# EAGLE design flasher (EAGLE 7.7.0)
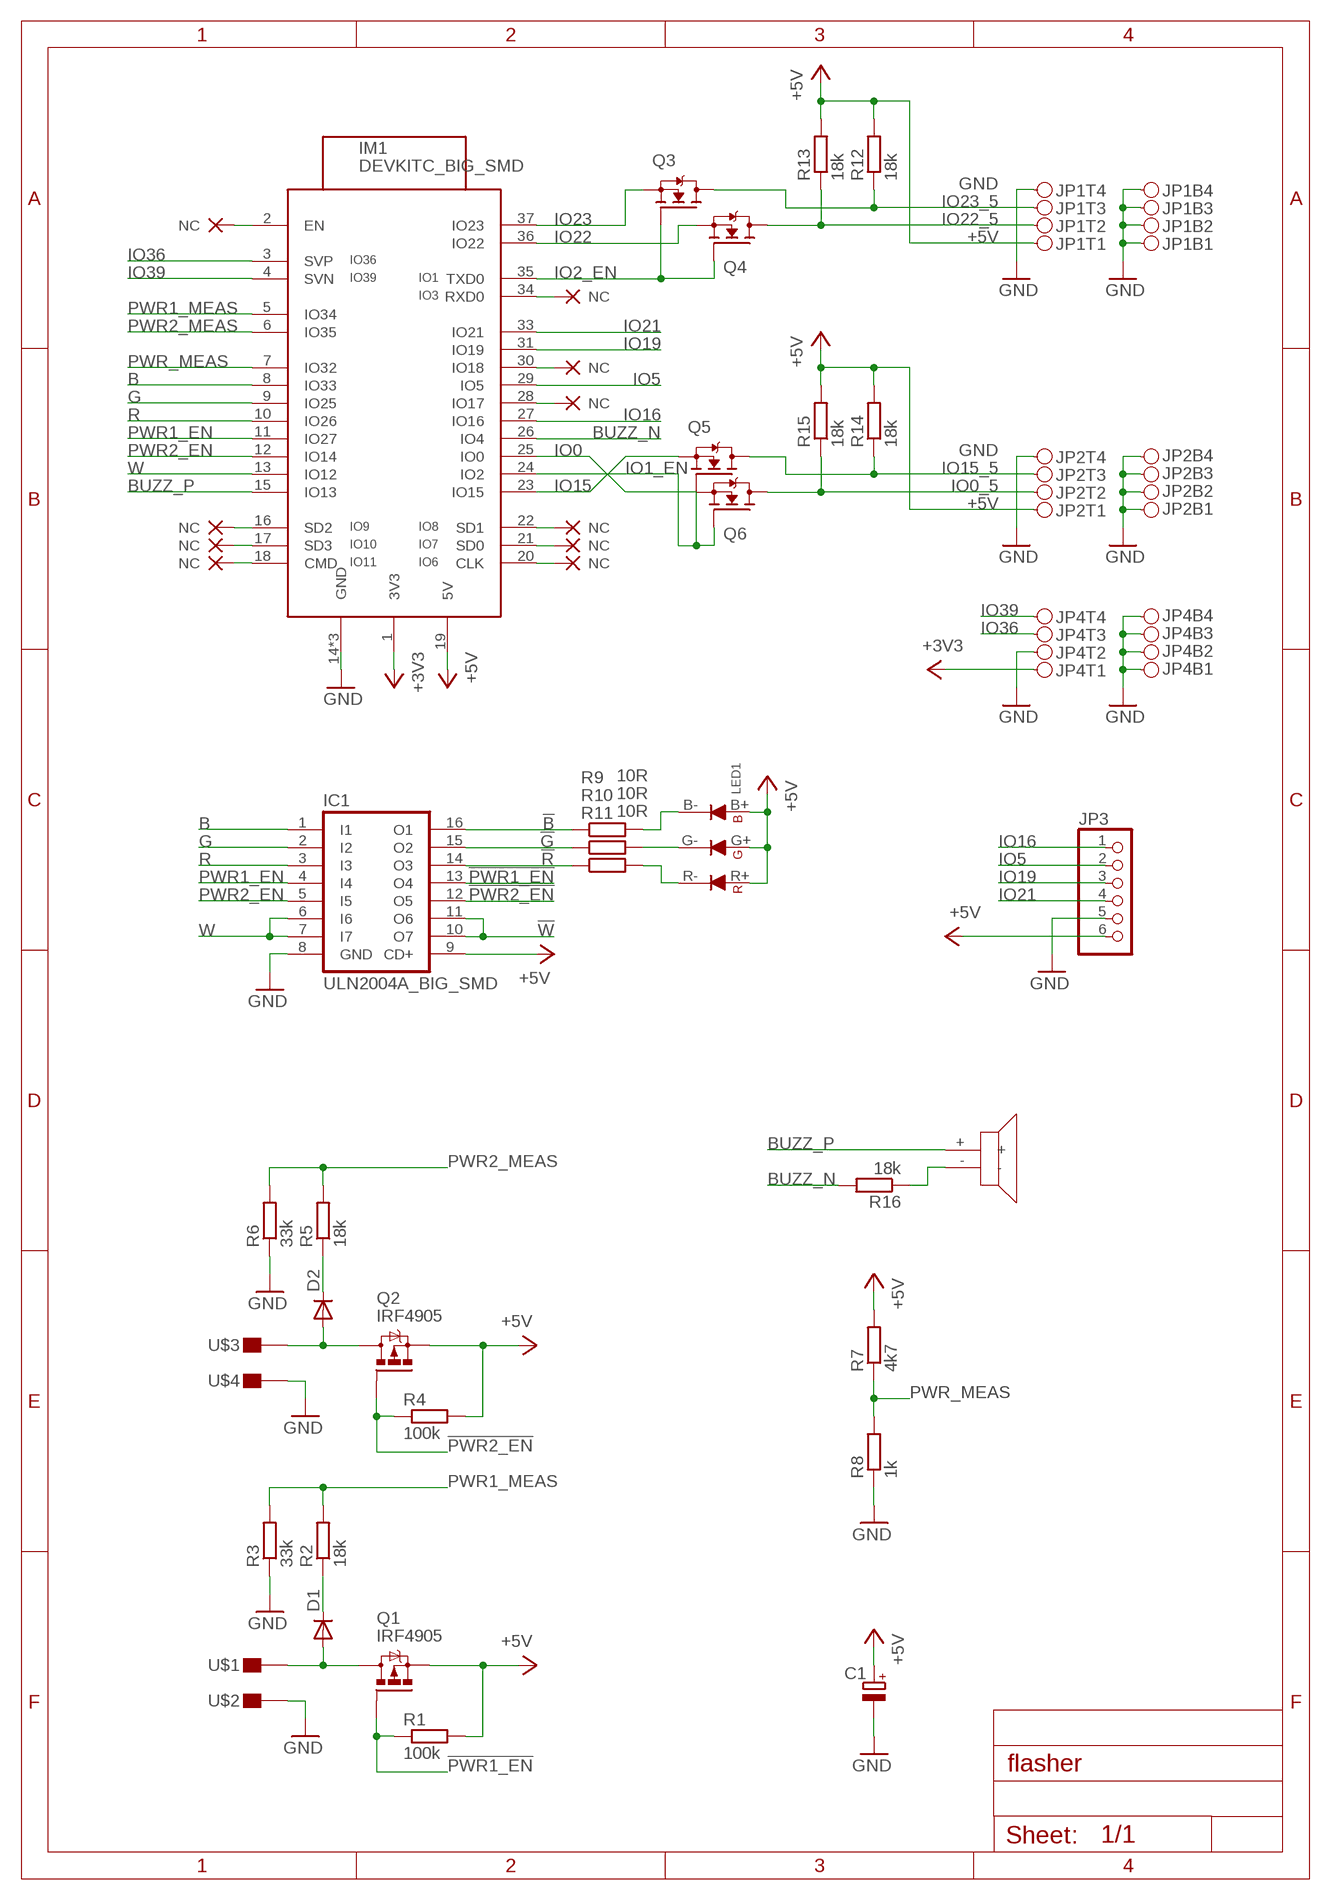
[diagram p0: schematic, sheet 1]

## Parts
C1  CPOL-EUE5-10.5  [E5-10,5]
D1  DIODE-SOD123  [SOD123]
D2  DIODE-SOD123  [SOD123]
IC1  ULN2004A_BIG_SMD  [DIL16_BIG_SMD]
IM1  DEVKITC_BIG_SMD  [DEVKITC_BIG_SMD]
JP1  PINH2X04  [PINH2X04SMD]
JP2  PINH2X04  [PINH2X04SMD]
JP3  PINHD-1X6  [1X06]
JP4  PINH2X04  [PINH2X04SMD]
LED1  RGB_LED  [HEX_HEATSINK]
NC1  NC  (no package)
NC2  NC  (no package)
NC3  NC  (no package)
NC4  NC  (no package)
NC5  NC  (no package)
NC6  NC  (no package)
NC7  NC  (no package)
NC8  NC  (no package)
NC9  NC  (no package)
NC10  NC  (no package)
Q1  IRF4905  IRF9530  [TO220BV]
Q2  IRF4905  IRF9530  [TO220BV]
Q3  N-MOSFET-SOT23-DIST  [SOT23_DIST]
Q4  N-MOSFET-SOT23-DIST  [SOT23_DIST]
Q5  N-MOSFET-SOT23-DIST  [SOT23_DIST]
Q6  N-MOSFET-SOT23-DIST  [SOT23_DIST]
R1  100k  R-EU_R0805S  [R0805S]
R2  18k  R-EU_R0805S  [R0805S]
R3  33k  R-EU_R0805S  [R0805S]
R4  100k  R-EU_R0805S  [R0805S]
R5  18k  R-EU_R0805S  [R0805S]
R6  33k  R-EU_R0805S  [R0805S]
R7  4k7  R-EU_R0805S  [R0805S]
R8  1k  R-EU_R0805S  [R0805S]
R9  10R  R-EU_R2512  [R2512]
R10  10R  R-EU_R2512  [R2512]
R11  10R  R-EU_R2512  [R2512]
R12  18k  R-EU_R0805S  [R0805S]
R13  18k  R-EU_R0805S  [R0805S]
R14  18k  R-EU_R0805S  [R0805S]
R15  18k  R-EU_R0805S  [R0805S]
R16  18k  R-EU_R0805S  [R0805S]
U$1  PAD_1SIDE_SMALL  [2X3MM]
U$2  PAD_1SIDE_SMALL  [2X3MM]
U$3  PAD_1SIDE_SMALL  [2X3MM]
U$4  PAD_1SIDE_SMALL  [2X3MM]
U$5  PIEZO  [PIEZO]

## Nets
!B: IC1.16(O1) R9.1
!G: IC1.15(O2) R10.1
!PWR1_EN: IC1.13(O4) Q1.G R1.1
!PWR2_EN: IC1.12(O5) Q2.G R4.1
!R: IC1.14(O3) R11.1
!W: IC1.10(O7) IC1.11(O6)
+3V3: IM1.1(3V3) JP4.T1
+5V: C1.+ IC1.9(CD+) IM1.19(5V) JP1.T1 JP2.T1 JP3.6 LED1.B+(BA) LED1.G+(GA) LED1.R+(RA) Q1.S Q2.S R1.2 R4.2 R7.2 R12.2 R13.2 R14.2 R15.2
B: IC1.1(I1) IM1.8(IO33)
BA: LED1.B-(BC) R9.2
BUZZ-N: R16.1 U$5.-
BUZZ_N: IM1.26(IO4) R16.2
BUZZ_P: IM1.15(IO13) U$5.+
EN: IM1.2(EN) NC7.NC
G: IC1.2(I2) IM1.9(IO25)
GA: LED1.G-(GC) R10.2
GND: C1.- IC1.8(GND) IM1.14(GND) IM1.32(GND) IM1.38(GND) JP1.B1 JP1.B2 JP1.B3 JP1.B4 JP1.T4 JP2.B1 JP2.B2 JP2.B3 JP2.B4 JP2.T4 JP3.5 JP4.B1 JP4.B2 JP4.B3 JP4.B4 JP4.T2 R3.1 R6.1 R8.1 U$2.1 U$4.1
IO0: IM1.25(IO0) Q6.2(S)
IO0_5: JP2.T2 Q6.3(D) R15.1
IO1_EN: IM1.24(IO2) Q5.1(G) Q6.1(G)
IO2_EN: IM1.35(TXD0) Q3.1(G) Q4.1(G)
IO3: IM1.34(RXD0) NC10.NC
IO5: IM1.29(IO5) JP3.2
IO6: IM1.20(CLK) NC4.NC
IO7: IM1.21(SD0) NC5.NC
IO8: IM1.22(SD1) NC6.NC
IO9: IM1.16(SD2) NC1.NC
IO10: IM1.17(SD3) NC2.NC
IO11: IM1.18(CMD) NC3.NC
IO15: IM1.23(IO15) Q5.2(S)
IO15_5: JP2.T3 Q5.3(D) R14.1
IO16: IM1.27(IO16) JP3.1
IO17: IM1.28(IO17) NC9.NC
IO18: IM1.30(IO18) NC8.NC
IO19: IM1.31(IO19) JP3.3
IO21: IM1.33(IO21) JP3.4
IO22: IM1.36(IO22) Q4.2(S)
IO22_5: JP1.T2 Q4.3(D) R13.1
IO23: IM1.37(IO23) Q3.2(S)
IO23_5: JP1.T3 Q3.3(D) R12.1
IO36: IM1.3(SVP) JP4.T3
IO39: IM1.4(SVN) JP4.T4
PWR1: D1.A Q1.D U$1.1
PWR1+: D1.C R2.1
PWR1_EN: IC1.4(I4) IM1.11(IO27)
PWR1_MEAS: IM1.5(IO34) R2.2 R3.2
PWR2: D2.A Q2.D U$3.1
PWR2+: D2.C R5.1
PWR2_EN: IC1.5(I5) IM1.12(IO14)
PWR2_MEAS: IM1.6(IO35) R5.2 R6.2
PWR_MEAS: IM1.7(IO32) R7.1 R8.2
R: IC1.3(I3) IM1.10(IO26)
RA: LED1.R-(RC) R11.2
W: IC1.6(I6) IC1.7(I7) IM1.13(IO12)

## Library data of the parts
C1 = rcl_upravena:CPOL-EU: POLARIZED CAPACITOR, European symbol
D1 D2 = diode:DIODE: DIODE ultra fast-recovery rectifier
IC1 = uln-udn_upravena:ULN2004A: DRIVER ARRAY
IM1 = esp32:DEVKITC
JP1 JP2 JP4 = pinhead_smd:PINH2X04
JP3 = pinhead:PINHD-1X6: PIN HEADER
LED1 = RGB_LED:RGB_LED
NC1-NC10 = NC:NC: _EXTERNAL_
Q1 Q2 = transistor-power:IRF9530: P-CHANNEL HEXFET POWER-MOS-FET Source: http://www.irf.com/product-info/datasheets/data/irf9530.pdf
Q3-Q6 = transistors:N-MOSFET
R1-R16 = rcl_upravena:R-EU_: RESISTOR, European symbol
U$1-U$4 = wirepad_smd:PAD
U$5 = piezo:PIEZO

## Board
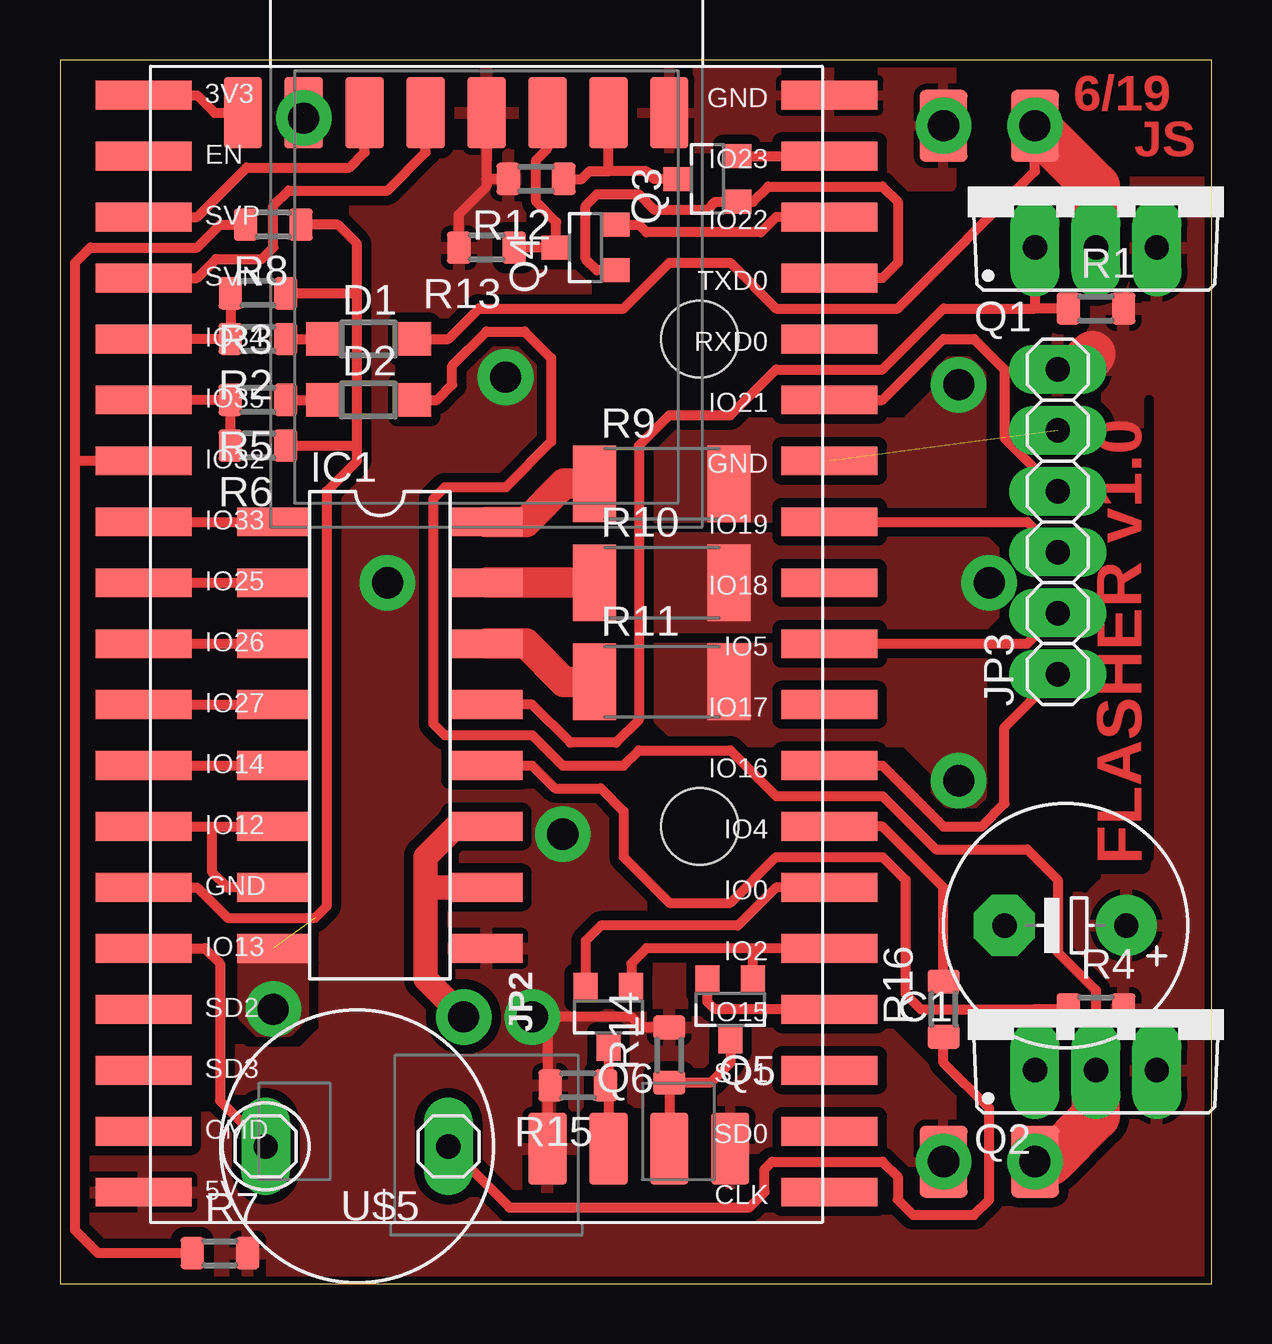
[diagram p1: board, top side]
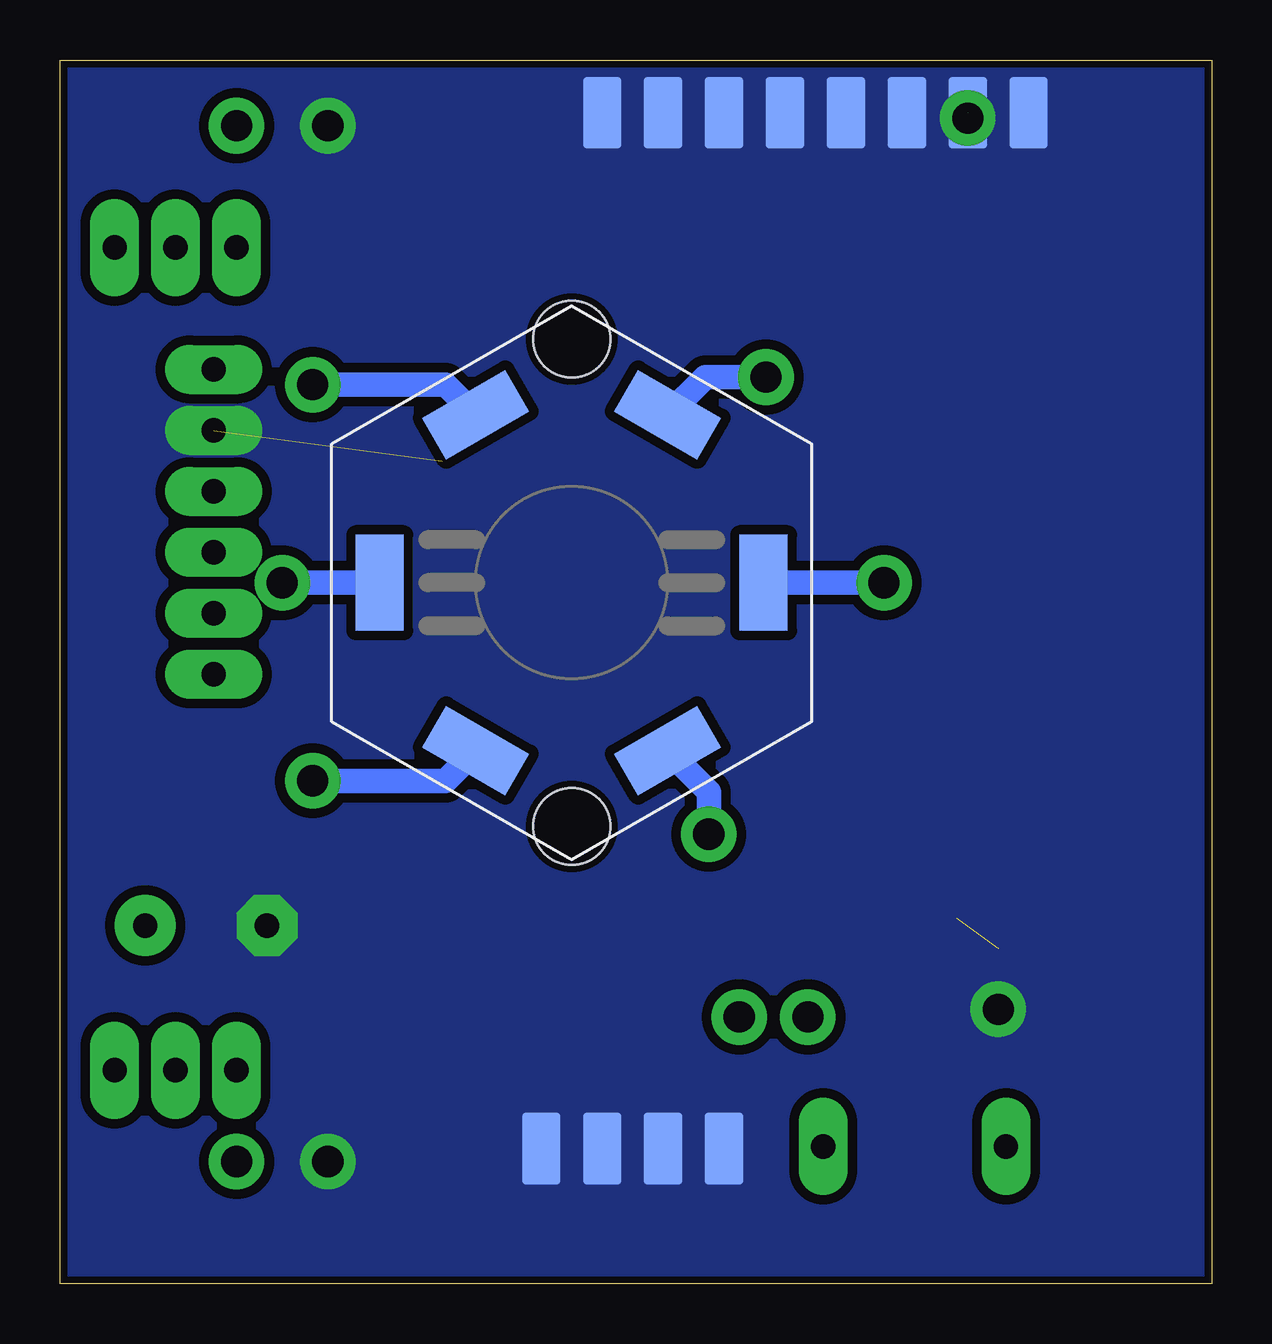
[diagram p2: board, bottom side, seen from below]

Size 48 x 51 mm. Coordinates in mm from the lower left corner, seen from the top.
Outline: 0,0 48,0 48,51 0,51 0,0
Copper layers (1*16): Top 0.035mm / dielectric 1.5mm / Bottom 0.035mm
Design rules "default *": minimum track width 0.4mm, minimum drill 0.8mm, track to track 0.4mm, track to pad 0.4mm, pad to pad 0.4mm, via to via 0.4mm, smd to smd 0mil, copper to edge 0.3mm, drill to drill 8mil, minimum pad ring 0.4mm, minimum via ring 0.3mm, stop-mask expansion 4mil, vias tented up to drill 0mil, thermal gap 10mil
Holes 3.2 mm at 26.67,39.37 26.67,19.05
tRestrict: area 23.8,16.2 to 29.6,21.9; area 23.8,36.5 to 29.6,42.3; 3 lines

### Footprints (pad centres in the part's own frame; a part is rotated, then mirrored left to right if it is on the bottom)
E5-10,5 = drill 1.016 pad 2.54: + -2.54,0 | drill 1.016 pad 2.54 octagon: - 2.54,0
SOD123 = smd 1.4 x 1.4: A 1.9,0; C -1.9,0
DIL16_BIG_SMD = smd 1.2 x 3: 1 -8.89,-4.445; 2 -6.35,-4.445; 3 -3.81,-4.445; 4 -1.27,-4.445; 5 1.27,-4.445; 6 3.81,-4.445; 7 6.35,-4.445; 8 8.89,-4.445; 9 8.89,4.445; 10 6.35,4.445; 11 3.81,4.445; 12 1.27,4.445; 13 -1.27,4.445; 14 -3.81,4.445; 15 -6.35,4.445; 16 -8.89,4.445
DEVKITC_BIG_SMD = smd 4 x 1.2: 1 -14.3,46.99; 2 -14.3,44.45; 3 -14.3,41.91; 4 -14.3,39.37; 5 -14.3,36.83; 6 -14.3,34.29; 7 -14.3,31.75; 8 -14.3,29.21; 9 -14.3,26.67; 10 -14.3,24.13; 11 -14.3,21.59; 12 -14.3,19.05; 13 -14.3,16.51; 14 -14.3,13.97; 15 -14.3,11.43; 16 -14.3,8.89; 17 -14.3,6.35; 18 -14.3,3.81; 19 -14.3,1.27; 20 14.3,1.27; 21 14.3,3.81; 22 14.3,6.35; 23 14.3,8.89; 24 14.3,11.43; 25 14.3,13.97; 26 14.3,16.51; 27 14.3,19.05; 28 14.3,21.59; 29 14.3,24.13; 30 14.3,26.67; 31 14.3,29.21; 32 14.3,31.75; 33 14.3,34.29; 34 14.3,36.83; 35 14.3,39.37; 36 14.3,41.91; 37 14.3,44.45; 38 14.3,46.99
PINH2X04SMD = smd 1.6 x 3 bottom: B1 -3.81,-2; B2 -1.27,-2; B3 1.27,-2; B4 3.81,-2 | smd 1.6 x 3: T1 -3.81,-2; T2 -1.27,-2; T3 1.27,-2; T4 3.81,-2
1X06 = drill 1.016 long: 1 -6.35,0; 2 -3.81,0; 3 -1.27,0; 4 1.27,0; 5 3.81,0; 6 6.35,0
HEX_HEATSINK = smd 4 x 2 rotated 330: B+ 4,7; R- -4,-7 | smd 4 x 2 rotated 210: B- -4,7; R+ 4,-7 | smd 2 x 4: G+ 8,0; G- -8,0
TO220BV = drill 1.016 long: D 0,-2.54; G -2.54,-2.54; S 2.54,-2.54
SOT23_DIST = smd 1 x 1.2: 1 -0.95,-1.227; 2 0.95,-1.227; 3 0,1.227
R0805S = smd 1 x 1.35: 1 -1.15,0; 2 1.15,0
R2512 = smd 1.8 x 3.2: 1 -2.8,0; 2 2.8,0
2X3MM = smd 2 x 3: 1 0,0
PIEZO = drill 1.016 long: + 1.27,8.89; - 1.27,1.27

### Placement (x,y rotation side)
C1  41.91,14.92 180 top
D1  12.86,39.37 0 top
D2  12.86,36.83 0 top
IC1  13.33,22.86 270 top
IM1  17.78,2.54 0 top
JP1  21.59,50.8 0 top
JP2  24.13,7.62 0 top
JP3  41.59,31.75 90 top
JP4  11.43,50.8 0 top
LED1  26.67,29.21 0 bottom
Q1  43.18,45.72 0 top
Q2  43.18,11.43 0 top
Q3  26.99,46.04 90 top
Q4  21.91,43.18 90 top
Q5  27.94,11.43 180 top
Q6  22.86,11.11 180 top
R1  43.18,40.64 0 top
R2  8.26,39.37 180 top
R3  8.26,41.27 180 top
R4  43.18,11.43 0 top
R5  8.26,36.83 180 top
R6  8.26,34.93 180 top
R7  6.67,1.27 0 top
R8  8.89,44.13 180 top
R9  25.08,33.34 0 top
R10  25.08,29.21 0 top
R11  25.08,25.08 0 top
R12  19.84,46.04 180 top
R13  17.78,43.18 180 top
R14  25.4,9.52 90 top
R15  21.59,8.25 180 top
R16  36.83,11.43 90 top
U$1  40.64,48.26 180 top
U$2  36.83,48.26 180 top
U$3  40.64,5.08 180 top
U$4  36.83,5.08 180 top
U$5  17.46,4.45 90 top

### Tracks (layer width: path | path; a pad name or v marks a point on that pad's centre or on a via)
!B
  Top 1.27: IC1.16 19.42,31.75 21.01,33.34 R9.1
!G
  Top 1.27: IC1.15 R10.1
!PWR1_EN
  Top 0.406: 40.64,40.64 36.83,40.64 34.29,38.1 29.84,38.1 27.94,36.2 25.4,36.2 24.13,34.93 24.13,23.5 23.18,22.54 21.27,22.54 19.69,24.13 IC1.13 | Q1.G 40.64,40.64 | R1.1 40.64,40.64
!PWR2_EN
  Top 0.406: IC1.12 19.69,21.59 20.64,20.64 22.54,20.64 23.49,19.69 23.49,17.78 25.4,15.88 27.94,15.88 29.84,17.78 34.29,17.78 35.24,16.83 35.24,12.07 35.88,11.43 40.64,11.43 | 40.64,11.43 Q2.G | R4.1 40.64,11.43
!R
  Top 1.27: IC1.14 19.42,26.67 21.01,25.08 R11.1
!W  (via drill 1.3)
  Top 1.016: IC1.11 16.51,19.05 15.24,17.78 15.24,16.51 | 15.24,16.51 15.24,12.7 v16.83,11.11 | IC1.10 15.24,16.51
+3V3
  Top 0.406: IM1.1 5.71,49.53 6.45,48.8 JP4.T1
+5V  (via drill 1.3)
  Top 0.406: JP1.T1 17.78,46.04 | 17.78,46.04 17.78,45.72 16.63,44.57 R13.2 | R12.2 17.78,46.04 | R14.2 24.25,10.68 23.81,11.11 20.64,11.11 20.32,10.8 20.32,8.25 | 20.32,8.25 JP2.T1 | R15.2 20.32,8.25
  Top 1.93: JP3.6 42.39,38.1 43.02,38.73
  Bottom 1.016: LED1.R+ 20.95,20.5 v20.95,18.73 | LED1.G+ v13.65,29.21 | LED1.B+ 21.1,37.78 v18.57,37.78
  other vias: 19.69,11.11
  pour Top (rank 3): 0,50.8 0,0 48.1,0 48.1,50.8
B
  Top 0.406: IM1.8 IC1.1
BA  (via drill 1.3)
  Bottom 1.016: LED1.B- 31.93,37.47 v37.47,37.47
  pour Top (rank 2, no thermals): 24.61,31.75 38.42,31.75 38.42,38.1 38.1,38.42 36.83,38.42 36.51,38.1 36.51,37.15 35.24,35.88 25.88,35.88 24.61,34.61
BUZZ-N
  Top 0.406: U$5.- 18.73,3.17 28.73,3.17 29.37,3.81 29.37,4.76 29.69,5.08 34.29,5.08 34.93,4.45 34.93,3.49 35.56,2.86 38.1,2.86 38.73,3.49 38.73,7.3 36.83,9.21 R16.1
BUZZ_N
  Top 0.406: IM1.26 34.29,19.05 36.83,16.51 R16.2
BUZZ_P
  Top 0.406: IM1.15 6.03,13.97 6.67,13.34 6.67,7.62 U$5.+
G
  Top 0.406: IM1.9 IC1.2
GA  (via drill 1.3)
  Bottom 1.016: LED1.G- v38.73,29.21
  pour Top (no thermals): 24.61,31.12 38.42,31.12 39.69,29.84 39.69,28.57 38.42,27.3 24.61,27.3
GND  (via drill 1.3)  (3 unrouted)
  Top 0.406: IM1.14 5.71,16.51 6.98,15.24 10.64,15.24 11.11,15.72 11.11,33.02 12.38,34.29 12.38,34.93 | R6.1 12.38,34.93 | 12.38,34.93 12.38,41.27 | 12.38,41.27 12.38,43.34 11.59,44.13 R8.1 | R3.1 12.38,41.27
  other vias: 8.89,11.43 36.83,5.08 36.83,48.26 10.16,48.58
  pour Top (no thermals): 7.62,14.29 10.16,14.29 10.16,11.11 9.53,10.48 8.26,10.48 7.62,11.11
  pour Bottom (rank 3, no thermals): 0,0 48.26,0 48.26,50.8 0,50.8
  pour Top: 24.13,50.8 37.15,50.8 37.15,45.72 29.21,45.72 27.62,47.31 24.13,47.31
  pour Top (rank 2): 27.62,10.48 34.61,10.48 37.15,7.94 37.15,4.13 27.62,4.13
IO0
  Top 0.406: IM1.25 29.84,16.51 28.26,14.92 22.54,14.92 21.91,14.29 Q6.2
IO0_5
  Top 0.406: Q6.3 22.86,8.25 | 22.86,8.25 JP2.T2 | R15.1 22.86,8.25
IO1_EN
  Top 0.406: IM1.24 28.89,13.97 | 28.89,13.97 24.45,13.97 23.81,13.34 Q6.1 | Q5.1 28.89,13.97
IO2_EN
  Top 0.406: Q4.1 22.38,42.23 21.91,42.7 21.91,44.93 22.38,45.4 24.13,45.4 24.77,44.77 26.99,44.77 27.3,45.09 Q3.1 28.9,45.09 29.53,45.72 34.29,45.72 34.93,45.09 34.93,42.55 34.29,41.91 IM1.35
IO5
  Top 0.406: IM1.29 40.32,26.67 JP3.2
IO15
  Top 0.406: IM1.23 27.3,11.43 26.99,11.75 Q5.2
IO15_5
  Top 0.406: JP2.T3 R14.1 27.11,8.38 27.94,9.21 Q5.3
IO16
  Top 0.406: IM1.27 34.29,21.59 36.83,19.05 38.42,19.05 39.37,20 39.37,23.18 JP3.1
IO19
  Top 0.406: IM1.31 40.32,31.75 JP3.3
IO21
  Top 0.406: IM1.33 34.29,36.83 36.83,39.37 38.1,39.37 39.37,38.1 39.37,35.24 JP3.4
IO22
  Top 0.406: IM1.36 29.84,44.45 29.21,43.81 24.45,43.81 24.13,44.13 Q4.2
IO22_5
  Top 0.406: JP1.T2 20.32,47.31 19.84,46.83 19.84,45.09 20.68,44.25 Q4.3 R13.1
IO23
  Top 0.406: Q3.2 IM1.37
IO23_5
  Top 0.406: Q3.3 24.77,46.04 24.45,46.36 22.86,46.36 | 22.86,46.36 JP1.T3 | R12.1 21.75,46.04 22.07,46.36 22.86,46.36
IO36
  Top 0.406: IM1.3 5.71,44.45 7.78,46.51 12.06,46.51 12.7,47.15 JP4.T3
IO39
  Top 0.406: IM1.4 5.71,41.91 6.51,42.7 8.41,42.7 8.89,43.18 8.89,44.93 9.53,45.56 13.65,45.56 15.24,47.15 JP4.T4
PWR1  (via drill 1.3)
  Top 0.406: D1.A 16.19,39.37 17.46,40.64 23.49,40.64 25.4,42.55 27.94,42.55 29.84,40.64 34.93,40.64 40.64,46.36 U$1.1
  Top 2: Q1.D 43.18,45.72 U$1.1
  other vias: 40.64,48.26
PWR1+
  Top 0.406: R2.1 D1.C
PWR1_EN
  Top 0.406: IM1.11 IC1.4
PWR1_MEAS
  Top 0.406: IM1.5 R2.2 R3.2
PWR2  (via drill 1.3)
  Top 0.406: D2.A 15.72,36.83 16.35,37.47 16.35,38.26 17.78,39.69 19.37,39.69 20.48,38.58 20.48,35.08 18.57,33.18 16.03,33.18 15.56,32.7 15.56,23.34 16.03,22.86 19.69,22.86 20.95,21.59 23.49,21.59 24.13,22.23 27.94,22.23 29.84,20.32 34.29,20.32 36.51,18.1 40.32,18.1 41.59,16.83 41.59,13.81 43.18,12.22 Q2.D
  Top 2: U$3.1 41.27,5.08 43.18,6.99 Q2.D
  other vias: 40.64,5.08
PWR2+
  Top 0.406: R5.1 D2.C
PWR2_EN
  Top 0.406: IM1.12 IC1.5
PWR2_MEAS
  Top 0.406: IM1.6 R5.2 R6.2
PWR_MEAS
  Top 0.406: R7.1 1.59,1.27 0.63,2.22 0.63,34.29 | 0.63,34.29 0.63,42.55 1.27,43.18 5.71,43.18 6.67,44.13 R8.2 | IM1.7 0.63,34.29
R
  Top 0.406: IM1.10 IC1.3
RA  (via drill 1.3)
  Bottom 1.016: LED1.R- 31.93,20.96 v37.47,20.96
  pour Top (rank 2, no thermals): 24.61,26.67 38.42,26.67 38.42,20.32 38.1,20 36.83,20 36.51,20.32 36.51,21.27 35.24,22.54 25.88,22.54 24.61,23.81
W
  Top 0.406: IM1.13 6.35,19.05 | 6.35,19.05 IC1.6 | IC1.7 6.98,16.51 6.35,17.14 6.35,19.05

### Text on the board
Top: 6/19 | JS | FLASHER v1.0